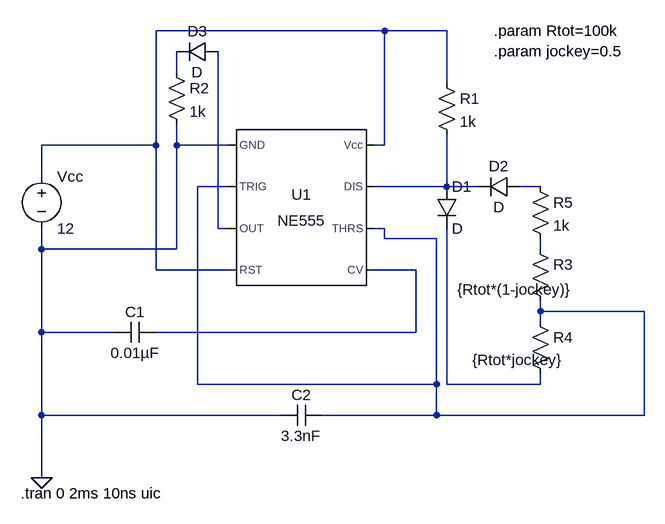
[diagram p0: schematic 2.2 LTspice Schematic.asc]
2.2 LTspice Schematic.asc, the LTspice schematic file:
Version 4.1
SHEET 1 984 680
WIRE 320 -64 -32 -64
WIRE 416 -64 320 -64
WIRE 0 0 0 -32
WIRE 416 16 416 -64
WIRE -32 112 -32 -64
WIRE -32 112 -208 112
WIRE 0 112 0 80
WIRE 80 112 0 112
WIRE 320 112 320 -64
WIRE 320 112 304 112
WIRE -208 160 -208 112
WIRE 80 176 32 176
WIRE 416 176 416 96
WIRE 416 176 304 176
WIRE 464 176 416 176
WIRE 560 176 528 176
WIRE 64 240 64 -32
WIRE 80 240 64 240
WIRE 320 240 304 240
WIRE 320 256 320 240
WIRE 400 256 320 256
WIRE -208 272 -208 240
WIRE 0 272 0 112
WIRE 0 272 -208 272
WIRE 560 272 560 256
WIRE -32 304 -32 112
WIRE 80 304 -32 304
WIRE 368 304 304 304
WIRE 560 368 560 352
WIRE 720 368 560 368
WIRE 560 384 560 368
WIRE -208 400 -208 272
WIRE -96 400 -208 400
WIRE 368 400 368 304
WIRE 368 400 -32 400
WIRE 32 480 32 176
WIRE 400 480 400 256
WIRE 400 480 32 480
WIRE 416 480 416 240
WIRE 560 480 560 464
WIRE 560 480 416 480
WIRE -208 528 -208 400
WIRE 160 528 -208 528
WIRE 400 528 400 480
WIRE 400 528 224 528
WIRE 720 528 720 368
WIRE 720 528 400 528
WIRE -208 624 -208 528
FLAG -208 624 0
SYMBOL Misc\\NE555 192 208 R0
SYMATTR InstName U1
SYMBOL voltage -208 144 R0
WINDOW 123 0 0 Left 0
WINDOW 39 0 0 Left 0
SYMATTR InstName Vcc
SYMATTR Value 12
SYMBOL cap -32 384 R90
WINDOW 0 0 32 VBottom 2
WINDOW 3 32 32 VTop 2
SYMATTR InstName C1
SYMATTR Value 0.01µF
SYMBOL res 400 0 R0
SYMATTR InstName R1
SYMATTR Value 1k
SYMBOL res 544 256 R0
WINDOW 3 -112 78 Left 2
SYMATTR Value {Rtot*(1-jockey)}
SYMATTR InstName R3
SYMBOL res 544 368 R0
WINDOW 3 -89 75 Left 2
SYMATTR Value {Rtot*jockey}
SYMATTR InstName R4
SYMBOL cap 224 512 R90
WINDOW 0 0 32 VBottom 2
WINDOW 3 32 32 VTop 2
SYMATTR InstName C2
SYMATTR Value 3.3nF
SYMBOL diode 64 -48 R90
WINDOW 0 0 32 VBottom 2
WINDOW 3 32 32 VTop 2
SYMATTR InstName D3
SYMBOL diode 400 176 R0
SYMATTR InstName D1
SYMBOL diode 528 160 R90
WINDOW 0 0 32 VBottom 2
WINDOW 3 32 32 VTop 2
SYMATTR InstName D2
SYMBOL res -16 -16 R0
SYMATTR InstName R2
SYMATTR Value 1k
SYMBOL res 544 160 R0
SYMATTR InstName R5
SYMATTR Value 1k
TEXT 488 -64 Left 2 !.param Rtot=100k\n.param jockey=0.5
TEXT -240 648 Left 2 !.tran 0 2ms 10ns uic

The netlist it stands for:
* 2.2 LTspice Schematic.asc
X§U1 0 N003 N006 N001 N008 N003 N004 N001 NE555  ; pins GND TRIG OUT RST CV THRS DIS Vcc
Vcc N001 0 12
C1 N008 0 0.01µF
R1 N001 N004 1k
R3 N007 N003 {Rtot*(1-jockey)}
R4 N003 N009 {Rtot*jockey}
C2 N003 0 3.3nF
D3 N006 N002 D
D1 N004 N009 D
D2 N005 N004 D
R2 N002 0 1k
R5 N005 N007 1k
.model D D
.lib standard.dio
.param Rtot=100k
.param jockey=0.5
.tran 0 2ms 10ns uic
.lib NE555.sub
.backanno
.end